# Altium project ElsysProject.PrjPcb
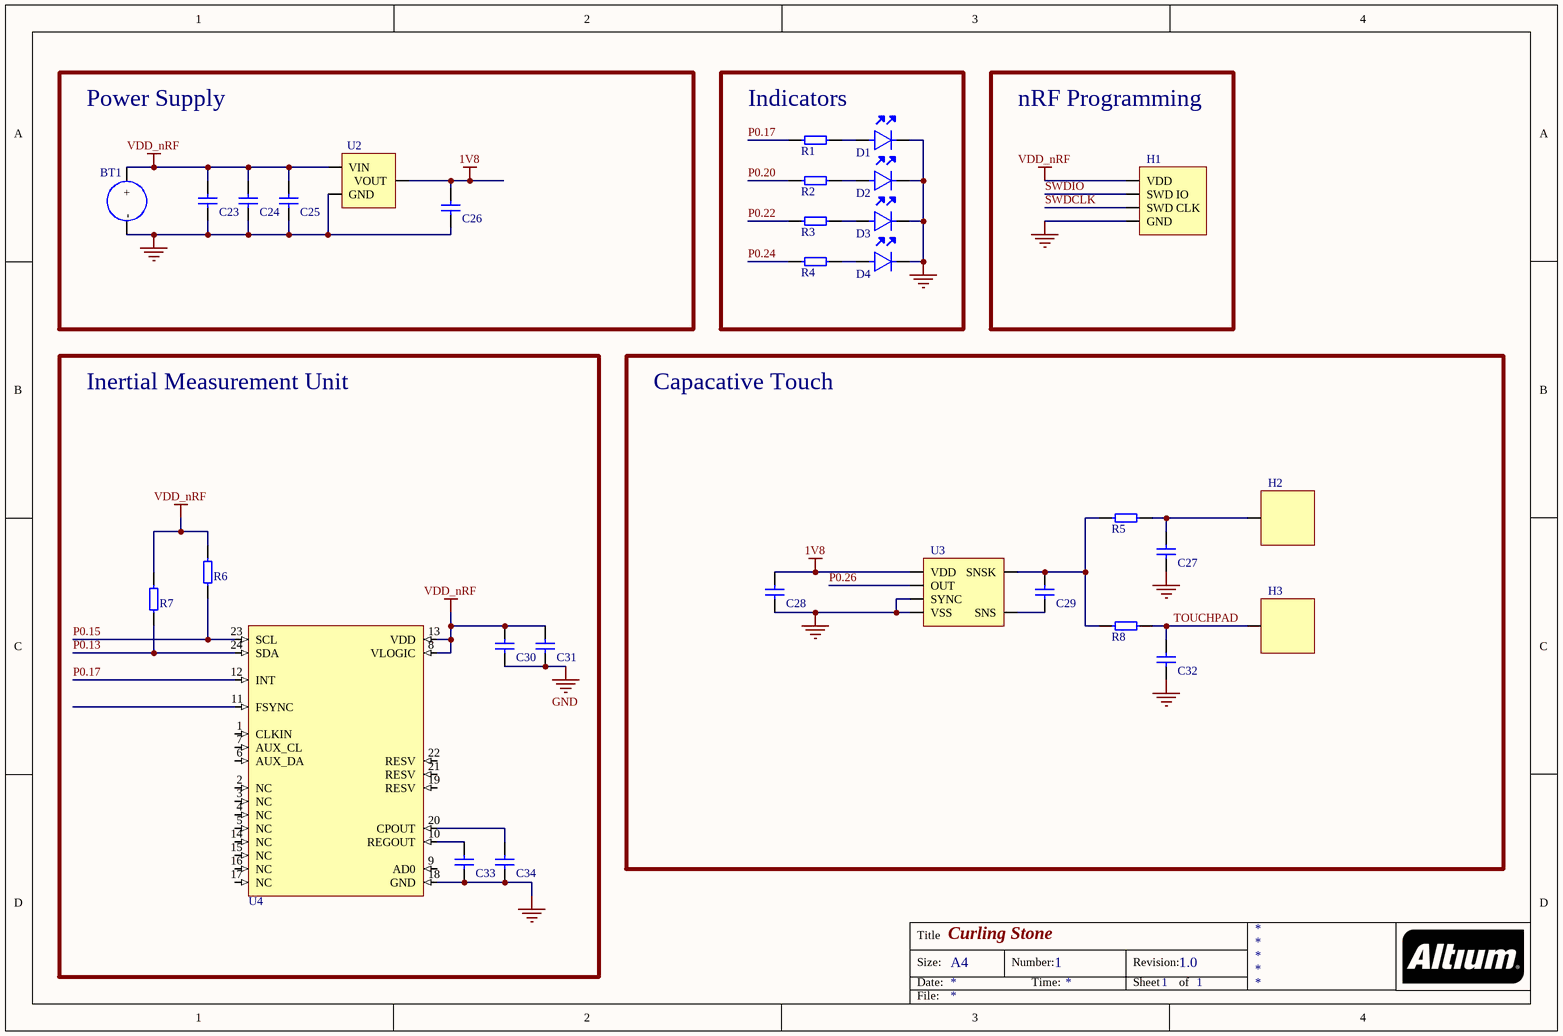
[diagram p0: CurlingStoneSchematic.SchDoc]
2 sheets, 58 parts. Net scope: global (net labels, ports and power ports of the same name join across sheets).
Board file: CurlingStonePCB.PcbDoc
Sheets:
  CurlingStoneSchematic.SchDoc
  nrf52840_qiaa.SchDoc

## Sheet CurlingStoneSchematic.SchDoc: Curling Stone
size A4; Author: Martin Moldsvor; DocumentNumber: 1; Revision: 1.0; SheetNumber: 1; SheetTotal: 1

### Parts
BT1  Battery Holder  [Battery Holder]  (value not drawn)
C23  0603 Capacitor  [0603]  (value not drawn)
C24  0603 Capacitor  [0603]  (value not drawn)
C25  0603 Capacitor  [0603]  (value not drawn)
C26  0603 Capacitor  [0603]  (value not drawn)
C27  0603 Capacitor  [0603]  (value not drawn)
C28  0603 Capacitor  [0603]  (value not drawn)
C29  0603 Capacitor  [0603]  (value not drawn)
C30  0603 Capacitor  [0603]  (value not drawn)
C31  0603 Capacitor  [0603]  (value not drawn)
C32  0603 Capacitor  [0603]  (value not drawn)
C33  0603 Capacitor  [0603]  (value not drawn)
C34  0603 Capacitor  [0603]  (value not drawn)
D1  0603 LED  [0603 LED]  (value not drawn)
D2  0603 LED  [0603 LED]  (value not drawn)
D3  0603 LED  [0603 LED]  (value not drawn)
D4  0603 LED  [0603 LED]  (value not drawn)
H1  4x1 Header  [4x1 HEADER TH]  (value not drawn)
H2  Electrode  [ELECTRODE EXTERNAL]  (value not drawn)
H3  Electrode  [ELECTRODE INTERNAL]  (value not drawn)
R1  0603 Resistor  [0603]  (value not drawn)
R2  0603 Resistor  [0603]  (value not drawn)
R3  0603 Resistor  [0603]  (value not drawn)
R4  0603 Resistor  [0603]  (value not drawn)
R5  0603 Resistor  [0603]  (value not drawn)
R6  0603 Resistor  [0603]  (value not drawn)
R7  0603 Resistor  [0603]  (value not drawn)
R8  0603 Resistor  [0603]  (value not drawn)
U2  MCP1700 1V8  [MCP1700 SOT-23]  (value not drawn)
U3  Capacative Touch  [CAPACATIVE TOUCH]  (value not drawn)
U4  MPU-6050  [MPU-6050]  (value not drawn)

### Blocks framed on the sheet
Power Supply: BT1 C23-C26 U2
Indicators: D1-D4 R1-R4
nRF Programming: H1
Inertial Measurement Unit: C30 C31 C33 C34 R6 R7 U4
Capacative Touch: C27-C29 C32 H2 H3 R5 R8 U3

### Nets
1V8: C26.2 C28.2 U2.2(VOUT) U3.5(VDD)
GND: BT1.2(-) C23.1 C24.1 C25.1 C26.1 C27.1 C28.1 C30.1 C31.1 C32.1 C33.1 C34.1 D1.2 D2.2 D3.2 D4.2 H1.2(GND) U2.1(GND) U3.2(VSS) U3.6(SYNC) U4.18(GND)
VDD_nRF: BT1.1(+) C23.2 C24.2 C25.2 C30.2 C31.2 H1.1(VDD) R6.2 R7.2 U2.3(VIN) U4.8(VLOGIC) U4.13(VDD)
P0.13: R7.1 U4.24(SDA)
P0.15: R6.1 U4.23(SCL)
P0.17: R1.1 U4.12(INT)
P0.20: R2.1
P0.22: R3.1
P0.24: R4.1
P0.26: U3.1(OUT)
SWDCLK: H1.4(SWD_CLK)
SWDIO: H1.3(SWD_IO)
TOUCHPAD: C32.2 H3.1(GND) R8.2
NetC27_2: C27.2 H2.1(GND) R5.2
NetC29_1: C29.1 U3.4(SNS)
NetC29_2: C29.2 R5.1 R8.1 U3.3(SNSK)
NetC33_2: C33.2 U4.10(REGOUT)
NetC34_2: C34.2 U4.20(CPOUT)
NetD1_1: D1.1 R1.2
NetD2_1: D2.1 R2.2
NetD3_1: D3.1 R3.2
NetD4_1: D4.1 R4.2

Not connected (* = marked no-connect by the designer): U4 1(CLKIN) 2(NC) 3(NC) 4(NC) 5(NC) 6(AUX_DA) 7(AUX_CL) 9(AD0) 11(FSYNC) 14(NC) 15(NC) 16(NC) 17(NC) 19(RESV) 21(RESV) 22(RESV)

### Notes on the sheet
- Title
- Size:
- Date:
- A4
- Number:
- Time:
- Revision:
- Sheet
- of
- File:

### Library data of the parts
BT1 = Battery Holder: Battery Holder 1-Cell 20mm Size Tin Nickel SMT Mount T/R; Manufacturer 1: Keystone Electronics; Manufacturer Part Number 1: 3034TR; Number of Batteries: 1; Supplier 1: Digi-Key; Supplier Part Number 1: 36-3034CT-ND; RoHS: Yes; Category: Uncategorized; Stock 1: 74655; Pricing 1: 1=0.42000, 25=0.37760, 100=0.28630, 250=0.25592 (USD); Mount: Surface Mount,PCB; Case/Package: SMD/SMT; Material: Bronze; Contact Plating: Tin; Termination: SMD/SMT; Packaging: Tape and Reel; Package Quantity: 500; Number of Cells: 1; Lead Free: Lead Free; ComponentLink1URL: https://datasheet.ciiva.com/29204/3034tr-29204080.pdf?src-supplier=Digi-Key; ComponentLink1Description: https://datasheet.ciiva.com/29204/3034tr-29204080.pdf?src-supplier=Digi-Key; ComponentLink2URL: https://datasheet.ciiva.com/41797/3034-41797079.pdf?src-supplier=Digi-Key; ComponentLink2Description: https://datasheet.ciiva.com/41797/3034-41797079.pdf?src-supplier=Digi-Key
D1-D4 = 0603 LED: LED Uni-Color Green 574nm 2-Pin Chip LED T/R; Manufacturer 1: Vishay Lite-On; Manufacturer Part Number 1: LTST-C191KGKT; Lens Color: Colorless; Power Rating: 75mW; Luminous Intensity: 35mcd; Viewing Angle: 130°; Lens Style: Rectangular,Colorless; Forward Current: 30mA; Forward Voltage: 2V; Dominant Wavelength: 571nm; Test Current: 20mA; Lens Transparency: Clear; Number of Elements: 1; Reverse Voltage: 5V; Supplier 1: Digi-Key; Supplier Part Number 1: 160-1446-1-ND; RoHS: Yes; Category: LEDs; Pricing 1: 1=0.26000, 10=0.14100, 100=0.06560, 500=0.06060, 1000=0.04747, 2000=0.04646 (USD); Mount: Surface Mount; Case/Package: 0603; Number of Pins: 2; Color: Green; Case Code (Metric): 1608; Case Code (Imperial): 0603; Min Operating Temperature: -55°C; Max Operating Temperature: 85°C; Packaging: Tape and Reel; Package Quantity: 1; Illumination Color: Green; Power Dissipation: 75mW; Wavelength: 574nm; Number of LEDs: 1; Max Power Dissipation: 75mW; Length: 1.6mm; Width: 0.8mm; Height: 0.55mm; Depth: 0.8mm; Radiation Hardening: No; Lead Free: Lead Free; RoHS Compliant: Yes; ComponentLink1URL: https://datasheet.ciiva.com/2109/ltst-c191kgkt-2109973.pdf?src-supplier=Digi-Key; ComponentLink1Description: https://datasheet.ciiva.com/2109/ltst-c191kgkt-2109973.pdf?src-supplier=Digi-Key
U2 = MCP1700 1V8: V REG, LDO 250MA, SMD, SOT-23-3; Output Voltage:1.8V; Dropout voltage:0.178V; No. of Pins:3; Voltage Regulator IC Case Style:SOT-23; Operating Temperature Range:-40°C to +125°C; Case Style:SOT-23; Max Operating Temperature:125°C; Min;RoHS Compliant: Yes; Manufacturer 1: Microchip; Manufacturer Part Number 1: MCP1700T-1802E/TT; Nominal Output Voltage: 1.8V; Min Input Voltage: 2.3V; Max Input Voltage: 6V; Dropout Voltage: 150mV; Number of Outputs: 1; Max Power Dissipation: 369.6mW; Input Bias Current: 1.6uA; Quiescent Current: 4uA; Polarity: Positive; Accuracy: 2%; Output Type: Fixed; Supplier 1: Digi-Key; Supplier Part Number 1: MCP1700T1802ETTCT-ND; RoHS: Yes; Category: Voltage Regulators - Linear; Stock 1: 24907; Pricing 1: 1=0.39000, 25=0.33000, 100=0.29000 (USD); Mount: Surface Mount; Case/Package: SOT-23; Number of Pins: 3; Min Operating Temperature: -40°C; Max Operating Temperature: 125°C; Packaging: Tape and Reel; Output Current: 250mA; Max Output Current: 250mA; Output Voltage: 1.8V; Max Supply Voltage: 6V; Min Supply Voltage: 2.3V; Package Quantity: 3000; Min Output Voltage: 1.8V; Max Output Voltage: 1.8V; Termination: SMD/SMT; Output Voltage Accuracy: 2%; Nominal Supply Current: 4uA; Power Dissipation: 369.6mW; Supply Current: 4uA; Length: 2.9mm; Width: 1.3mm; Height: 0.95mm; Radiation Hardening: No; REACH SVHC: No SVHC; Lead Free: Lead Free; RoHS Compliant: Yes; ComponentLink1URL: https://datasheet.ciiva.com/14150/mcp1700-eng-tds-14150117.pdf?src-supplier=Distrelec; ComponentLink1Description: https://datasheet.ciiva.com/14150/mcp1700-eng-tds-14150117.pdf?src-supplier=Distrelec; ComponentLink2URL: https://datasheet.ciiva.com/17364/jp011779-17364282.pdf?src-supplier=Avnet+Europe; ComponentLink2Description: https://datasheet.ciiva.com/17364/jp011779-17364282.pdf?src-supplier=Avnet+Europe; ComponentLink3URL: https://datasheet.ciiva.com/2040/21826b-2040109.pdf?src-supplier=Digi-Key; ComponentLink3Description: https://datasheet.ciiva.com/2040/21826b-2040109.pdf?src-supplier=Digi-Key; ComponentLink4URL: https://datasheet.ciiva.com/8041/21826b-8041597.pdf?src-supplier=Element14; ComponentLink4Description: https://datasheet.ciiva.com/8041/21826b-8041597.pdf?src-supplier=Element14; ComponentLink5URL: https://datasheet.ciiva.com/2040/21826b-2040110.pdf?src-supplier=Digi-Key; ComponentLink5Description: https://datasheet.ciiva.com/2040/21826b-2040110.pdf?src-supplier=Digi-Key; ComponentLink6URL: https://datasheet.ciiva.com/8237/jp011779-8237326.pdf?src-supplier=Avnet; ComponentLink6Description: https://datasheet.ciiva.com/8237/jp011779-8237326.pdf?src-supplier=Avnet; ComponentLink7URL: https://datasheet.ciiva.com/16218/filehandler-aspxddocname-en011779-16218350.pdf?src-supplier=Future+Electronics; ComponentLink7Description: https://datasheet.ciiva.com/16218/filehandler-aspxddocname-en011779-16218350.pdf?src-supplier=Future+Electronics
U3 = Capacative Touch: Capacitive Touch Screen 1Keys 6-Pin SOT-23 Tape and Reel; Manufacturer 1: Microchip / Atmel; Manufacturer Part Number 1: AT42QT1011-TSHR; Number of Inputs: 1; Resolution: 14b; Operating Supply Current: 378.5uA; Min Supply Voltage: 1.8V; Max Supply Voltage: 5.5V; Load Capacitance: 50pF; Nominal Supply Current: 729uA; Supplier 1: Digi-Key; Supplier Part Number 1: AT42QT1011-TSHRCT-ND; RoHS: Yes; Category: Uncategorized; Pricing 1: 1=0.61000, 25=0.56000, 100=0.50000 (USD); Mount: Surface Mount; Case/Package: SOT-23-6; Number of Pins: 6; Min Operating Temperature: -40°C; Max Operating Temperature: 85°C; Packaging: Tape and Reel; Package Quantity: 4500; Number of Channels: 1; Touchscreen: Capacitive; Series: QTouch™; Supply Current: 729uA; Length: 3mm; Width: 1.75mm; Height: 1.3mm; RoHS Compliant: Yes; REACH SVHC: No SVHC; Lead Free: Lead Free; ComponentLink1URL: https://datasheet.ciiva.com/1165/731627-1165685.pdf?src-supplier=Element14; ComponentLink1Description: https://datasheet.ciiva.com/1165/731627-1165685.pdf?src-supplier=Element14; ComponentLink2URL: https://datasheet.ciiva.com/14094/at42qt1011-eng-tds-14094872.pdf?src-supplier=Distrelec; ComponentLink2Description: https://datasheet.ciiva.com/14094/at42qt1011-eng-tds-14094872.pdf?src-supplier=Distrelec; ComponentLink3URL: https://datasheet.ciiva.com/1403/doc8287-1403456.pdf?src-supplier=Digi-Key; ComponentLink3Description: https://datasheet.ciiva.com/1403/doc8287-1403456.pdf?src-supplier=Digi-Key; ComponentLink4URL: https://datasheet.ciiva.com/1403/doc8287-1403457.pdf?src-supplier=Digi-Key; ComponentLink4Description: https://datasheet.ciiva.com/1403/doc8287-1403457.pdf?src-supplier=Digi-Key; ComponentLink5URL: https://datasheet.ciiva.com/1403/doc8287-1403458.pdf?src-supplier=Digi-Key; ComponentLink5Description: https://datasheet.ciiva.com/1403/doc8287-1403458.pdf?src-supplier=Digi-Key; ComponentLink6URL: https://datasheet.ciiva.com/15222/getdatasheetpartid-463081-15222284.pdf?src-supplier=Verical; ComponentLink6Description: https://datasheet.ciiva.com/15222/getdatasheetpartid-463081-15222284.pdf?src-supplier=Verical
U4 = MPU-6050: INVENSENSE   MPU-6050   GYRO / ACCEL, 6-AXIS, I2C, QFN-24; Manufacturer 1: TDK InvenSense; Sensor Type: Accelerometer,Gyroscope,3 Axis; Supplier 1: Digi-Key; Supplier Part Number 1: 1428-1007-1-ND; Manufacturer Part Number 1: MPU-6050; RoHS: Yes; Category: Inertial Measurement Units (IMUs); Stock 1: 3318; Pricing 1: 1=7.55000, 5=6.62400, 10=5.96200, 25=5.30000, 50=4.90240, 100=4.24000, 500=3.97500, 1000=3.71000 (USD); Mount: Surface Mount; Case/Package: QFN; Min Operating Temperature: -40°C; Max Operating Temperature: 85°C; Packaging: Tape and Reel; Output Type: I2C; Series: -; RoHS Compliant: Yes; ComponentLink1URL: https://datasheet.ciiva.com/1513/1788002-1513632.pdf?src-supplier=Element14; ComponentLink1Description: https://datasheet.ciiva.com/1513/1788002-1513632.pdf?src-supplier=Element14; ComponentLink2URL: https://datasheet.ciiva.com/22731/1788002-22731434.pdf?src-supplier=Element14; ComponentLink2Description: https://datasheet.ciiva.com/22731/1788002-22731434.pdf?src-supplier=Element14

## Sheet nrf52840_qiaa.SchDoc: nRF52840-QIAA Ref. Layout (DCDC, VDD supply)
size A4; Revision: 1.1; SheetNumber: 1; SheetTotal: 1; DrawnBy: RUBR; DocumentSize: A4; PCAName: nRF52840-QIAA Ref. Layout (DCDC, VDD supply, NFC)
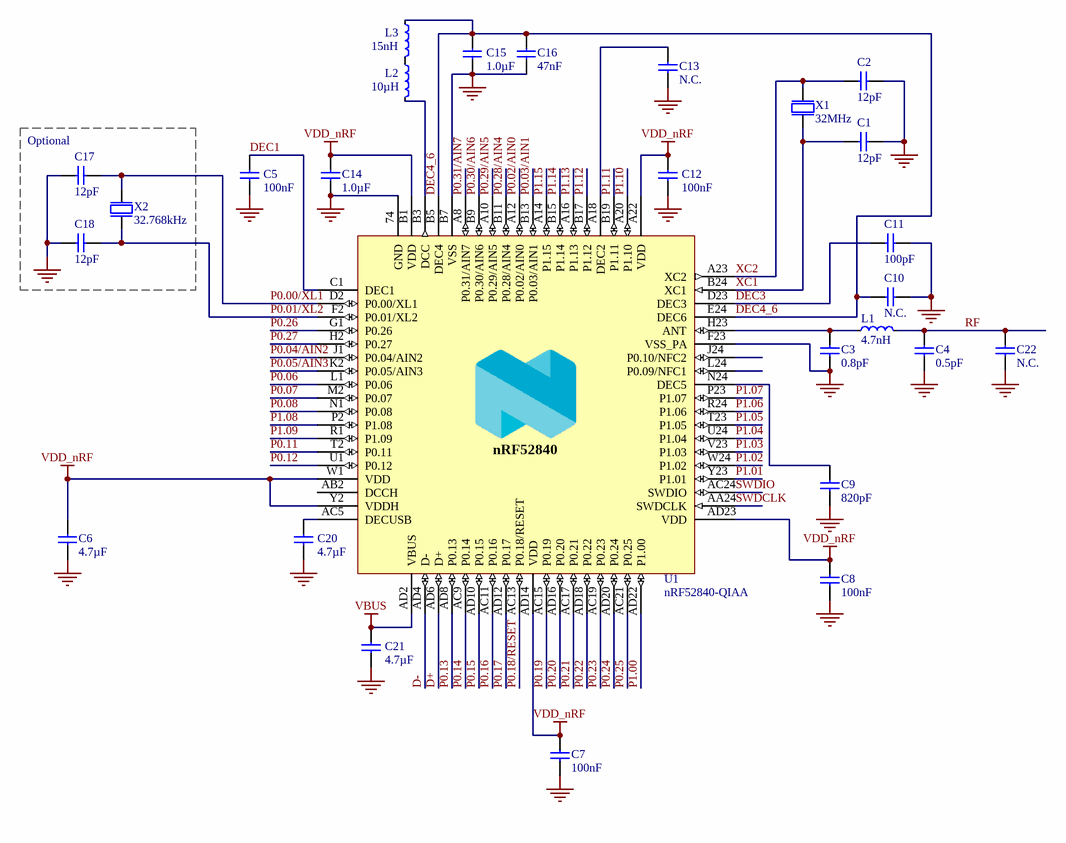
[diagram p1: nrf52840_qiaa.SchDoc]

### Parts
C1  12pF  [CAPC1005X04L]
C2  12pF  [CAPC1005X04L]
C3  0.8pF  [CAPC1005X04L]
C4  0.5pF  [CAPC1005X04L]
C5  100nF  [CAPC1005X04L]
C6  4.7µF  [CAPC1608X06L]
C7  100nF  [CAPC1005X04L]
C8  100nF  [CAPC1005X04L]
C9  820pF  [CAPC1005X04L]
C10  N.C.  [CAPC1005X04L]
C11  100pF  [CAPC1005X04L]
C12  100nF  [CAPC1005X04L]
C13  N.C.  [CAPC1005X04L]
C14  1.0µF  [CAPC1608X06L]
C15  1.0µF  [CAPC1608X06L]
C16  47nF  [CAPC1005X04L]
C17  12pF  [CAPC1005X04L]
C18  12pF  [CAPC1005X04L]
C20  4.7µF  [CAPC1608X06L]
C21  4.7µF  [CAPC1608X06L]
C22  N.C.  [CAPC1005X04L]
L1  4.7nH  [INDC1005X04L]
L2  10µH  [INDC1608X06L]
L3  15nH  [INDC1005X04L]
U1  nRF52840-QIAA  [AQFN50P700X700X85_HS-74N]
X1  32MHz  [BT-XTAL_2016]
X2  32.768kHz  [XTAL_3215]

### Blocks framed on the sheet
Optional: C17 C18 X2

### Nets
GND: C1.2 C2.2 C3.1 C4.1 C5.2 C6.2 C7.2 C8.2 C9.2 C10.1 C11.2 C12.2 C13.2 C14.2 C15.1 C16.2 C17.2 C18.2 C20.2 C21.2 C22.2 U1.74(GND) U1.B7(VSS) U1.F23(VSS_PA) X1.2(GND) X1.4(GND)
VBUS: C21.1 U1.AD2(VBUS)
VDD_nRF: C6.1 C7.1 C8.1 C12.1 C14.1 U1.A22(VDD) U1.AD14(VDD) U1.AD23(VDD) U1.B1(VDD) U1.W1(VDD) U1.Y2(VDDH)
D+: U1.AD6(D+)
D-: U1.AD4(D-)
DEC1: C5.1 U1.C1(DEC1)
DEC3: C11.1 U1.D23(DEC3)
DEC4_6: C10.2 C15.2 C16.1 L3.1 U1.B5(DEC4) U1.E24(DEC6)
P0.00/XL1: C17.1 U1.D2(P0.00/XL1) X2.1(inp)
P0.01/XL2: C18.1 U1.F2(P0.01/XL2) X2.2(out)
P0.02/AIN0: U1.A12(P0.02/AIN0)
P0.03/AIN1: U1.B13(P0.03/AIN1)
P0.04/AIN2: U1.J1(P0.04/AIN2)
P0.05/AIN3: U1.K2(P0.05/AIN3)
P0.06: U1.L1(P0.06)
P0.07: U1.M2(P0.07)
P0.08: U1.N1(P0.08)
P0.11: U1.T2(P0.11)
P0.12: U1.U1(P0.12)
P0.13: U1.AD8(P0.13)
P0.14: U1.AC9(P0.14)
P0.15: U1.AD10(P0.15)
P0.16: U1.AC11(P0.16)
P0.17: U1.AD12(P0.17)
P0.18/RESET: U1.AC13(P0.18/RESET)
P0.19: U1.AC15(P0.19)
P0.20: U1.AD16(P0.20)
P0.21: U1.AC17(P0.21)
P0.22: U1.AD18(P0.22)
P0.23: U1.AC19(P0.23)
P0.24: U1.AD20(P0.24)
P0.25: U1.AC21(P0.25)
P0.26: U1.G1(P0.26)
P0.27: U1.H2(P0.27)
P0.28/AIN4: U1.B11(P0.28/AIN4)
P0.29/AIN5: U1.A10(P0.29/AIN5)
P0.30/AIN6: U1.B9(P0.30/AIN6)
P0.31/AIN7: U1.A8(P0.31/AIN7)
P1.00: U1.AD22(P1.00)
P1.01: U1.Y23(P1.01)
P1.02: U1.W24(P1.02)
P1.03: U1.V23(P1.03)
P1.04: U1.U24(P1.04)
P1.05: U1.T23(P1.05)
P1.06: U1.R24(P1.06)
P1.07: U1.P23(P1.07)
P1.08: U1.P2(P1.08)
P1.09: U1.R1(P1.09)
P1.10: U1.A20(P1.10)
P1.11: U1.B19(P1.11)
P1.12: U1.B17(P1.12)
P1.13: U1.A16(P1.13)
P1.14: U1.B15(P1.14)
P1.15: U1.A14(P1.15)
RF: C4.2 C22.1 L1.2
SWDCLK: U1.AA24(SWDCLK)
SWDIO: U1.AC24(SWDIO)
XC1: C1.1 U1.B24(XC1) X1.1(inp)
XC2: C2.1 U1.A23(XC2) X1.3(out)
NetC3_2: C3.2 L1.1 U1.H23(ANT)
NetC9_1: C9.1 U1.N24(DEC5)
NetC13_1: C13.1 U1.A18(DEC2)
NetC20_1: C20.1 U1.AC5(DECUSB)
NetL2_1: L2.1 L3.2
NetL2_2: L2.2 U1.B3(DCC)

Not connected (* = marked no-connect by the designer): U1 AB2(DCCH) J24(P0.10/NFC2) L24(P0.09/NFC1)

### Notes on the sheet
- Title
- Size
- Date:
- A4
- Project Number
- Sheet         of
- Revision
- File:
- Drawn By:
- (in symbol nRF52840-QIAAD0) nRF52840

### Library data of the parts
C1 C2 C17 C18 = C0402-12p: Capacitor, NP0, ±2%; Note: 50V; Part Number: C0402-12p; LatestRevisionDate: 2011-05-11; Pin Count: 2; Publisher: Nordic Semiconductor; Published: 2009-05-08; Value: 12pF; Footprint Doc: 0402
C3 = C0402-0.8p: Capacitor, NP0, ±10%; Note: 50V; Part Number: C0402-0.8p; LatestRevisionDate: 2012-11-21; Pin Count: 2; Publisher: Nordic Semiconductor; Published: 2009-05-08; Value: 0.8pF; Footprint Doc: 0402
C4 = C0402-0.5p: Capacitor, NP0, ±10%; Note: 50V; Part Number: C0402-0.5p; LatestRevisionDate: 2017-02-23; Pin Count: 2; Publisher: Nordic Semiconductor; Published: 2009-05-08; Value: 0.5pF; Footprint Doc: 0402
C5 C7 C8 C12 = C0402-100n: Capacitor, X7R, ±10%; Note: 16V; Part Number: C0402-100n; LatestRevisionDate: 2009-11-23; Pin Count: 2; Publisher: Nordic Semiconductor; Published: 2009-05-08; Value: 100nF; Footprint Doc: 0402
C6 C20 = C0603-4µ7-6.3V-X7R: Capacitor, X7R, ±10%; Note: 6.3V; Part Number: C0603-4µ7-6.3V-X7R; LatestRevisionDate: 2015-06-10; Pin Count: 2; Publisher: Nordic Semiconductor; Published: 2015-06-10; Value: 4.7µF; Footprint Doc: 0603
C9 = C0402-820p: Capacitor, NP0, ±5%; Note: 50V; Part Number: C0402-820p; LatestRevisionDate: 2009-05-08; Pin Count: 2; Publisher: Nordic Semiconductor; Published: 2009-05-08; Value: 820pF; Footprint Doc: 0402
C10 C13 = C0402-N.C.: Not mounted; Assembly: Not mounted; Part Number: C0402-N.C.; LatestRevisionDate: 2009-05-08; Pin Count: 2; Publisher: Nordic Semiconductor; Published: 2009-05-08; Value: N.C.; Footprint Doc: 0402
C11 = C0402-100p: Capacitor, NP0, ±5%; Note: 50V; Part Number: C0402-100p; LatestRevisionDate: 2009-05-08; Pin Count: 2; Publisher: Nordic Semiconductor; Published: 2009-05-08; Value: 100pF; Footprint Doc: 0402
C14 C15 = C0603-1µ0: Capacitor, X7R, ±10%; Note: 16V; Part Number: C0603-1µ0; LatestRevisionDate: 2013-06-05; Pin Count: 2; Publisher: Nordic Semiconductor; Published: 2009-05-08; Value: 1.0µF; Footprint Doc: 0603
C16 = C0402-47n: Capacitor, X7R, ±10%; Note: Chip Cap 10%; Part Number: C0402-47n; LatestRevisionDate: 2009-05-08; Pin Count: 2; Publisher: Nordic Semiconductor; Published: 2009-05-08; Value: 47nF; Footprint Doc: 0402
C21 = C0603-4µ7-10V-X7S: Capacitor, X7S, ±10%; Note: 10V; Part Number: C0603-4µ7-10V-X7S; LatestRevisionDate: 2016-08-15; Pin Count: 2; Publisher: Nordic Semiconductor; Published: 2016-08-15; Value: 4.7µF; Footprint Doc: 0603
C22 = C0402-N.C.: Not mounted; Note: Chip Cap; Assembly: Not mounted; Part Number: C0402-N.C.; LatestRevisionDate: 2009-05-08; Pin Count: 2; Publisher: Nordic Semiconductor; Published: 2009-05-08; Value: N.C.; Footprint Doc: 0402
L1 = L0402-4n7: High frequency chip inductor ±5%; Part Number: L0402-4n7; LatestRevisionDate: 2012-09-19; Pin Count: 2; Publisher: Nordic Semiconductor; Published: 2009-05-08; Value: 4.7nH; Note: High frequency chip inductor ±5%; Footprint Doc: 0402
L2 = L0603-10µ: Chip inductor, IDC,min = 50 mA, ±20%; Part Number: L0603-10µ; LatestRevisionDate: 2012-09-19; Pin Count: 2; Publisher: Nordic Semiconductor; Published: 2010-02-24; Value: 10µH; Footprint Doc: 0603
L3 = L0402-15n: High frequency chip inductor ±10%; Part Number: L0402-15n; LatestRevisionDate: 2012-09-19; Pin Count: 2; Publisher: Nordic Semiconductor; Published: 2010-07-12; Value: 15nH; Footprint Doc: 0402
U1 = nRF52840-QIAAD0: Multi-protocol Bluetooth Low Energy, IEEE 802.15.4, ANT and 2.4GHz proprietary system-on-chip; Manufacturer: Nordic Semiconductor; Part Number: nRF52840-QIAAD0; LatestRevisionDate: 2018-12-04; Pin Count: 73; Publisher: Nordic Semiconductor; Published: 2018-12-04; Value: nRF52840-QIAA; Note: *; Footprint Doc: AQFN-73; Manufacturer Part Number: nRF52840-QIAAD0
X1 = XTAL_SMD2016_32MHz_8pF_General: XTAL SMD 2016, 32MHz, Cl=8pF, Total Tol: ±40ppm; Part Number: XTAL_SMD2016_32MHz_8pF_General; LatestRevisionDate: 2016-08-19; Pin Count: 4; Publisher: Nordic Semiconductor; Published: 2016-08-19; Value: 32MHz; Footprint Doc: XTAL_2016
X2 = XTAL_SMD3215_32.768kHz_9pF_General: XTAL SMD 3215, 32.768kHz, Cl=9pF, Total Tol: ±50ppm; Part Number: XTAL_SMD3215_32.768kHz_9pF_General; LatestRevisionDate: 2016-08-19; Pin Count: 2; Publisher: Nordic Semiconductor; Published: 2016-08-19; Value: 32.768kHz; Footprint Doc: XTAL_3215

## Nets that join several sheets
GND: CurlingStoneSchematic (21 pins), nrf52840_qiaa (26 pins)
VDD_nRF: CurlingStoneSchematic (12 pins), nrf52840_qiaa (11 pins)
P0.13: CurlingStoneSchematic (R7.1 U4.24), nrf52840_qiaa (U1.AD8)
P0.15: CurlingStoneSchematic (R6.1 U4.23), nrf52840_qiaa (U1.AD10)
P0.17: CurlingStoneSchematic (R1.1 U4.12), nrf52840_qiaa (U1.AD12)
P0.20: CurlingStoneSchematic (R2.1), nrf52840_qiaa (U1.AD16)
P0.22: CurlingStoneSchematic (R3.1), nrf52840_qiaa (U1.AD18)
P0.24: CurlingStoneSchematic (R4.1), nrf52840_qiaa (U1.AD20)
P0.26: CurlingStoneSchematic (U3.1), nrf52840_qiaa (U1.G1)
SWDCLK: CurlingStoneSchematic (H1.4), nrf52840_qiaa (U1.AA24)
SWDIO: CurlingStoneSchematic (H1.3), nrf52840_qiaa (U1.AC24)